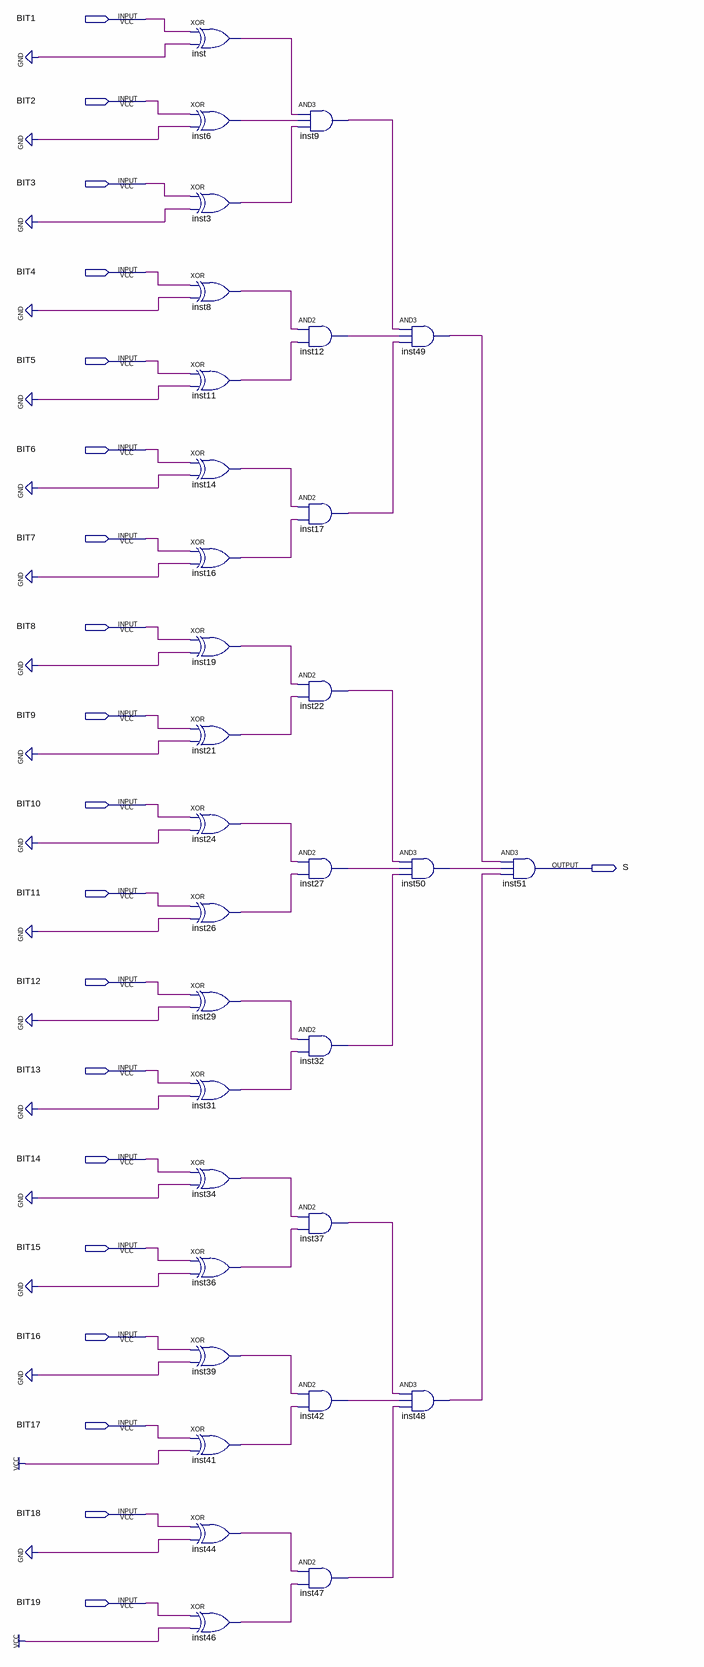
[diagram p0: schematic sheet]
// Quartus schematic comparadorContadorPulso.bdf as structural Verilog: 32 symbols, 20 pins
module comparadorContadorPulso (
  input  BIT1,
  input  BIT2,
  input  BIT3,
  input  BIT4,
  input  BIT5,
  input  BIT6,
  input  BIT7,
  input  BIT8,
  input  BIT9,
  input  BIT10,
  input  BIT11,
  input  BIT12,
  input  BIT13,
  input  BIT14,
  input  BIT15,
  input  BIT16,
  input  BIT17,
  input  BIT18,
  input  BIT19,
  output S
);

  wire inst3_out, inst6_out, inst8_out, inst9_out, inst11_out, inst12_out, inst14_out, inst16_out,
       inst17_out, inst19_out, inst21_out, inst22_out, inst24_out, inst26_out, inst27_out, inst29_out,
       inst31_out, inst32_out, inst34_out, inst36_out, inst37_out, inst39_out, inst41_out, inst42_out,
       inst44_out, inst46_out, inst47_out, inst48_out, inst49_out, inst50_out, inst_out;

  xor inst (inst_out, BIT1, 1'b0);
  xor inst6 (inst6_out, BIT2, 1'b0);
  xor inst3 (inst3_out, BIT3, 1'b0);
  xor inst8 (inst8_out, BIT4, 1'b0);
  xor inst11 (inst11_out, BIT5, 1'b0);
  xor inst14 (inst14_out, BIT6, 1'b0);
  xor inst16 (inst16_out, BIT7, 1'b0);
  xor inst19 (inst19_out, BIT8, 1'b0);
  xor inst21 (inst21_out, BIT9, 1'b0);
  xor inst24 (inst24_out, BIT10, 1'b0);
  xor inst26 (inst26_out, BIT11, 1'b0);
  xor inst29 (inst29_out, BIT12, 1'b0);
  xor inst31 (inst31_out, BIT13, 1'b0);
  xor inst34 (inst34_out, BIT14, 1'b0);
  xor inst36 (inst36_out, BIT15, 1'b0);
  xor inst39 (inst39_out, BIT16, 1'b0);
  xor inst41 (inst41_out, BIT17, 1'b1);
  xor inst44 (inst44_out, BIT18, 1'b0);
  xor inst46 (inst46_out, BIT19, 1'b1);
  and inst9 (inst9_out, inst_out, inst6_out, inst3_out);
  and inst12 (inst12_out, inst8_out, inst11_out);
  and inst17 (inst17_out, inst14_out, inst16_out);
  and inst22 (inst22_out, inst19_out, inst21_out);
  and inst27 (inst27_out, inst24_out, inst26_out);
  and inst32 (inst32_out, inst29_out, inst31_out);
  and inst37 (inst37_out, inst34_out, inst36_out);
  and inst42 (inst42_out, inst39_out, inst41_out);
  and inst47 (inst47_out, inst44_out, inst46_out);
  and inst49 (inst49_out, inst9_out, inst12_out, inst17_out);
  and inst50 (inst50_out, inst22_out, inst27_out, inst32_out);
  and inst48 (inst48_out, inst37_out, inst42_out, inst47_out);
  and inst51 (S, inst49_out, inst50_out, inst48_out);
endmodule
